# EAGLE design ROM-Adapter5 (EAGLE 9.6.2)
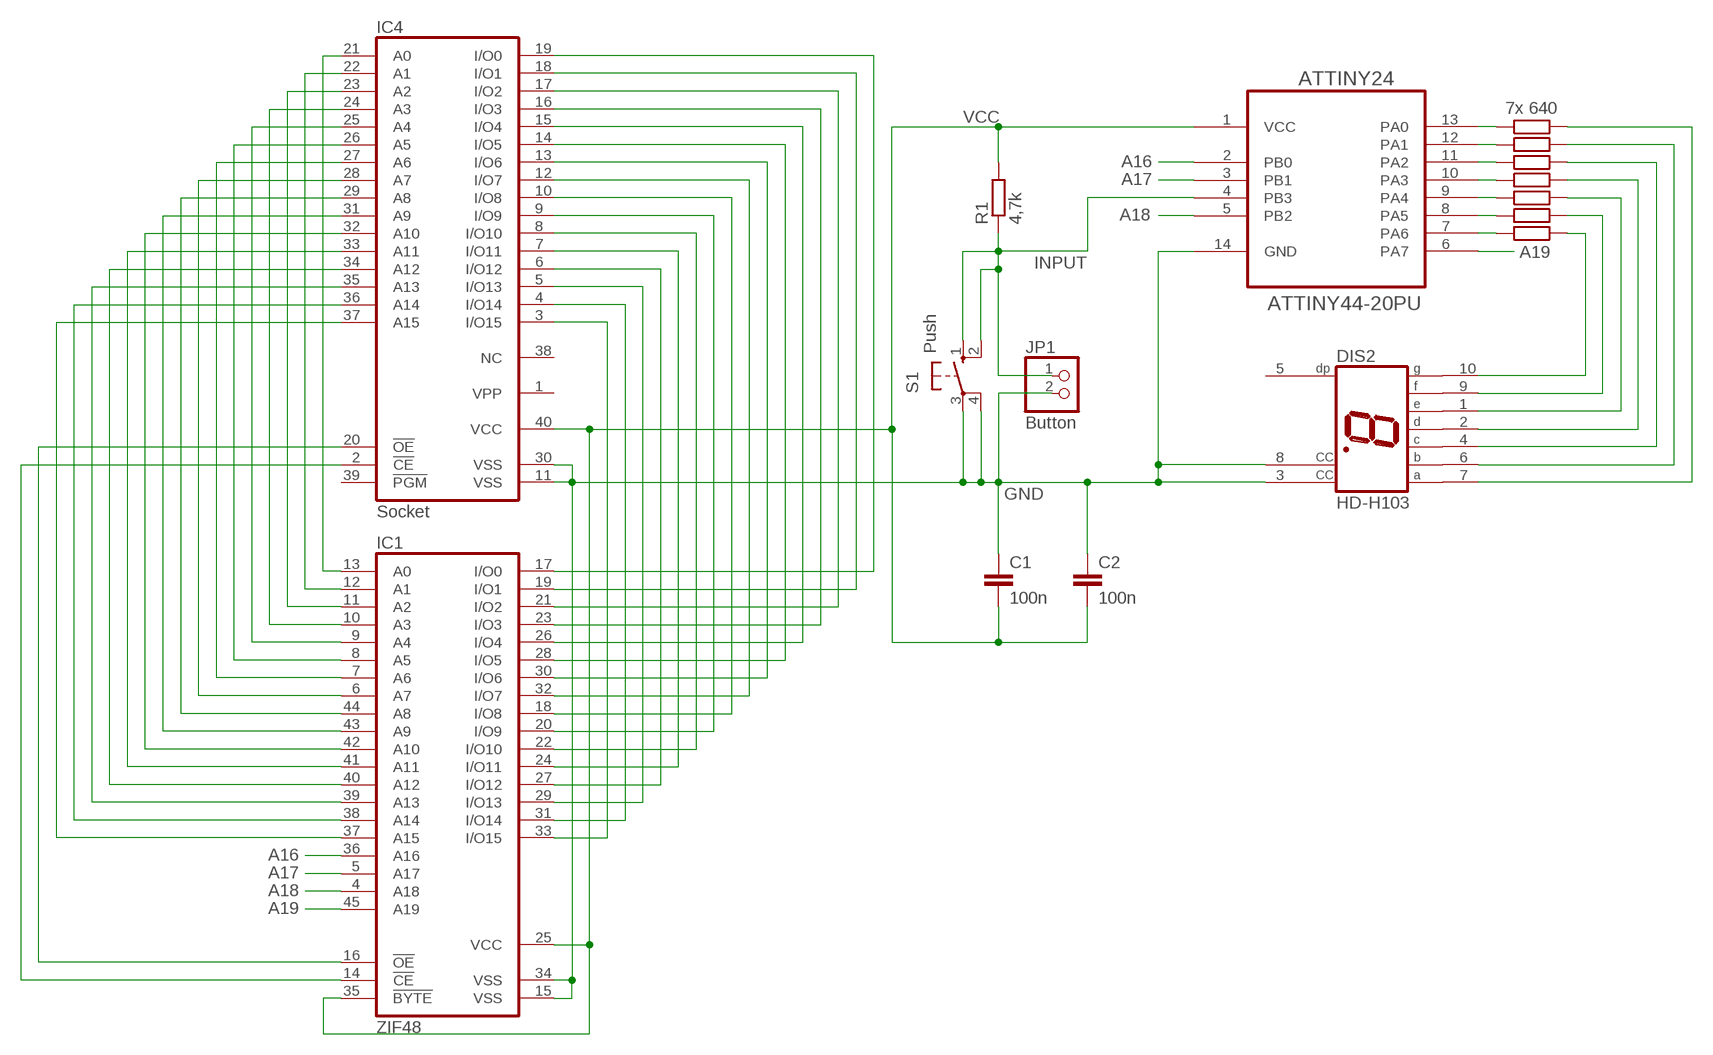
[diagram p0: schematic, sheet 1]

## Parts
ATTINY24  ATTINY44-20PU  [DIP254P762X533-14]
C1  100n  C-EU025-030X050  [C025-030X050]
C2  100n  C-EU025-030X050  [C025-030X050]
DIS2  HD-H103  [HDSP-M]
IC1  ZIF48  MEMORY-M27C160  [MEMORY-HITACHI_ZIF48]
IC4  Socket  27C1024HG  [DIL40]
JP1  Button  PINHD-1X2  [1X02]
R1  4,7k  R-EU_0207/10  [0207/10]
R2  7x 640  R-EU_0207/10  [0207/10]
R3  640  R-EU_0207/10  [0207/10]
R4  640  R-EU_0207/10  [0207/10]
R5  640  R-EU_0207/10  [0207/10]
R6  640  R-EU_0207/10  [0207/10]
R7  640  R-EU_0207/10  [0207/10]
R8  640  R-EU_0207/10  [0207/10]
S1  Push  10-XX  [B3F-10XX]

## Nets
A16: ATTINY24.2(PB0) IC1.36(A16)
A17: ATTINY24.3(PB1) IC1.5(A17)
A18: ATTINY24.5(PB2) IC1.4(A18)
A19: ATTINY24.6(PA7) IC1.45(A19)
GND [power]: ATTINY24.14(GND) C1.1 C2.1 DIS2.3(CC) DIS2.8(CC) IC1.15(VSS) IC1.34(VSS) IC4.11(VSS) IC4.30(VSS) JP1.2 S1.3(P) S1.4(P1)
INPUT: ATTINY24.4(PB3) JP1.1 R1.1 S1.1(S) S1.2(S1)
N$1: IC1.13(A0) IC4.21(A0)
N$2: IC1.12(A1) IC4.22(A1)
N$3: ATTINY24.13(PA0) R2.1
N$4: IC1.11(A2) IC4.23(A2)
N$5: IC1.10(A3) IC4.24(A3)
N$6: IC1.9(A4) IC4.25(A4)
N$7: IC1.8(A5) IC4.26(A5)
N$8: IC1.7(A6) IC4.27(A6)
N$9: IC1.6(A7) IC4.28(A7)
N$10: IC1.44(A8) IC4.29(A8)
N$11: IC1.43(A9) IC4.31(A9)
N$12: IC1.42(A10) IC4.32(A10)
N$13: IC1.41(A11) IC4.33(A11)
N$14: IC1.40(A12) IC4.34(A12)
N$15: IC1.39(A13) IC4.35(A13)
N$16: IC1.38(A14) IC4.36(A14)
N$17: IC1.37(A15) IC4.37(A15)
N$18: IC1.16(!OE) IC4.20(!OE)
N$19: IC1.14(!CE) IC4.2(!CE)
N$20: DIS2.10(G) R8.2
N$21: IC1.33(I/O15) IC4.3(I/O15)
N$22: DIS2.9(F) R7.2
N$23: IC1.31(I/O14) IC4.4(I/O14)
N$24: IC1.29(I/O13) IC4.5(I/O13)
N$25: IC1.27(I/O12) IC4.6(I/O12)
N$26: IC1.24(I/O11) IC4.7(I/O11)
N$27: IC1.22(I/O10) IC4.8(I/O10)
N$28: IC1.20(I/O9) IC4.9(I/O9)
N$29: IC1.18(I/O8) IC4.10(I/O8)
N$30: IC1.32(I/O7) IC4.12(I/O7)
N$31: IC1.30(I/O6) IC4.13(I/O6)
N$32: IC1.28(I/O5) IC4.14(I/O5)
N$33: IC1.26(I/O4) IC4.15(I/O4)
N$34: IC1.23(I/O3) IC4.16(I/O3)
N$35: IC1.21(I/O2) IC4.17(I/O2)
N$36: IC1.19(I/O1) IC4.18(I/O1)
N$37: IC1.17(I/O0) IC4.19(I/O0)
N$38: ATTINY24.12(PA1) R3.1
N$39: ATTINY24.11(PA2) R4.1
N$40: ATTINY24.10(PA3) R5.1
N$41: ATTINY24.9(PA4) R6.1
N$42: ATTINY24.8(PA5) R7.1
N$43: ATTINY24.7(PA6) R8.1
N$44: DIS2.1(E) R6.2
N$45: DIS2.2(D) R5.2
N$46: DIS2.4(C) R4.2
N$47: DIS2.6(B) R3.2
N$48: DIS2.7(A) R2.2
VCC [power]: ATTINY24.1(VCC) C1.2 C2.2 IC1.25(VCC) IC1.35(!BYTE) IC4.40(VCC) R1.2
Unconnected: DIS2.5(DP) IC4.1(VPP) IC4.38(NC) IC4.39(!PGM)

## Library data of the parts
ATTINY24 = Atmel_By_element14_Batch_1-00:ATTINY44-20PU: 8-bit Microcontroller with In-System Programmable Flash; MPN: ATTINY44-20PU; OC_FARNELL: 1455150; OC_NEWARK: 58M3786; PACKAGE: PDIP-14; SUPPLIER: Atmel
C1 C2 = rcl:C-EU: CAPACITOR, European symbol; SPICEPREFIX: C
DIS2 = display-hp:HD-H103: LED DISPLAY 1-character 7 segment, decimal point right; OC_FARNELL: unknown; OC_NEWARK: unknown
IC1 = ZIF40ROM:MEMORY-M27C160: MEMORY
IC4 = memory-hitachi:27C1024HG: MEMORY; OC_FARNELL: unknown; OC_NEWARK: unknown
JP1 = pinhead:PINHD-1X2: PIN HEADER
R1-R8 = rcl:R-EU_: RESISTOR, European symbol; SPICEPREFIX: R
S1 = switch-omron:10-XX: OMRON SWITCH; MPN: B3F-1000; OC_FARNELL: 176432; OC_NEWARK: 36M3542

## Net classes
0 default: width 0.305 mm
1 power: width 0.406 mm

## Board
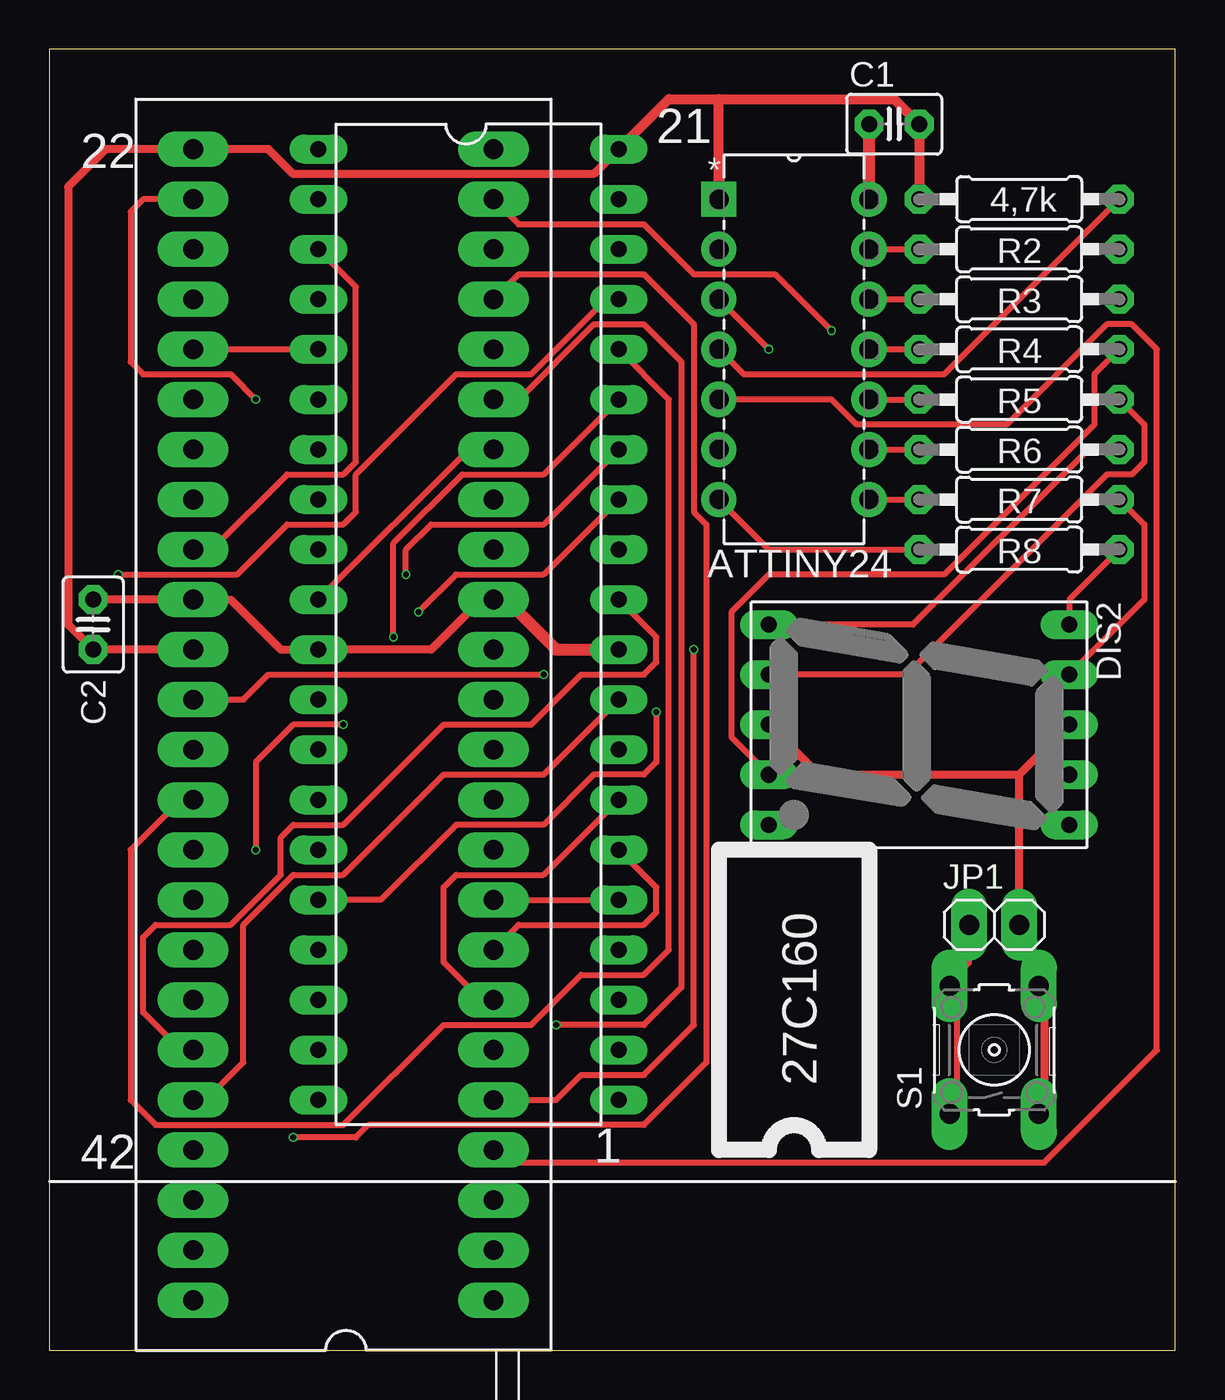
[diagram p1: board, top side]
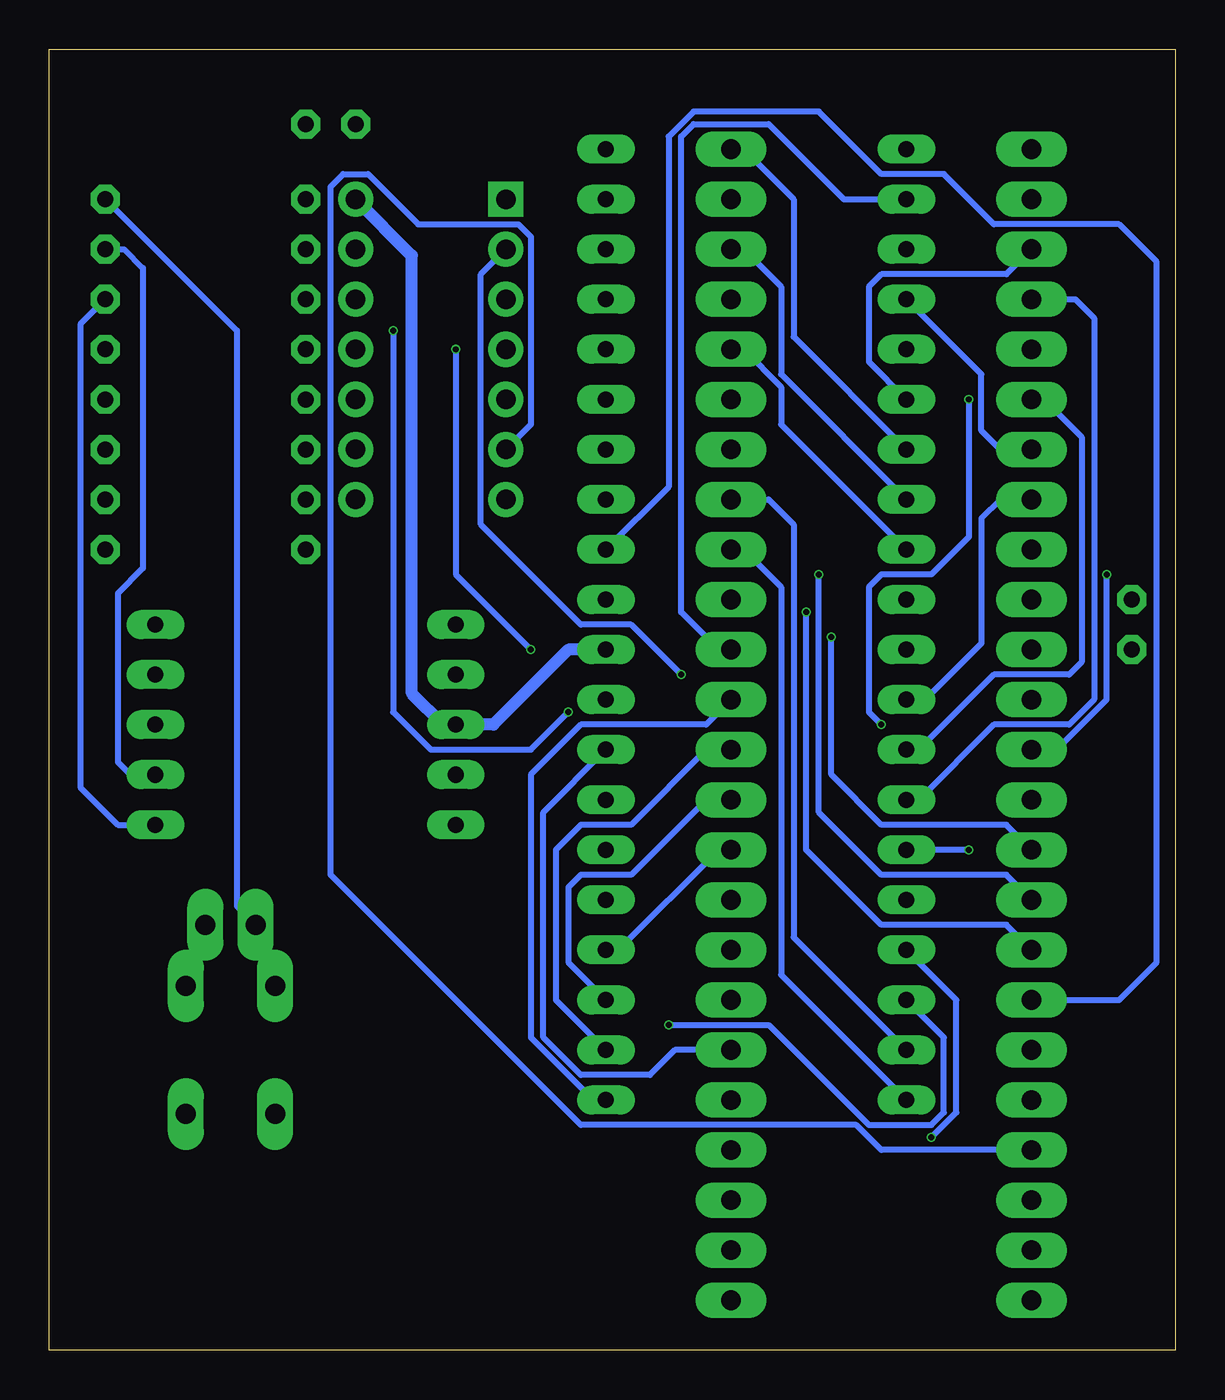
[diagram p2: board, bottom side, seen from below]

Size 57.14 x 66.03 mm. Coordinates in mm from the lower left corner, seen from the top.
Outline: 0,0 57.14,0 57.14,66.03 0,66.03 0,0
Copper layers (1*16): Top 0.035mm / dielectric 1.6mm / Bottom 0.035mm
Design rules "jlcpcb-2layers": minimum track width 5mil, minimum drill 0.3mm, track to track 5mil, track to pad 5mil, pad to pad 5mil, via to via 5mil, smd to smd 5mil, copper to edge 0.2mm, drill to drill 6mil, minimum pad ring 10mil, minimum via ring 3mil, stop-mask expansion 4mil, vias tented up to drill 0mil, thermal gap 10mil

### Footprints (pad centres in the part's own frame; a part is rotated, then mirrored left to right if it is on the bottom)
DIP254P762X533-14 = drill 0.991 square: 1 -7.62,15.24 | drill 0.991: 2 -7.62,12.7; 3 -7.62,10.16; 4 -7.62,7.62; 5 -7.62,5.08; 6 -7.62,2.54; 7 -7.62,0; 8 0,0; 9 0,2.54; 10 0,5.08; 11 0,7.62; 12 0,10.16; 13 0,12.7; 14 0,15.24
C025-030X050 = drill 0.813 octagon: 1 -1.27,0; 2 1.27,0
HDSP-M = drill 0.813 long: 1 -5.08,-7.62; 2 -2.54,-7.62; 3 0,-7.62; 4 2.54,-7.62; 5 5.08,-7.62; 6 5.08,7.62; 7 2.54,7.62; 8 0,7.62; 9 -2.54,7.62; 10 -5.08,7.62
MEMORY-HITACHI_ZIF48 = drill 1 long: 1 -24.13,-7.62; 2 -21.59,-7.62; 3 -19.05,-7.62; 4 -16.51,-7.62; 5 -13.97,-7.62; 6 -11.43,-7.62; 7 -8.89,-7.62; 8 -6.35,-7.62; 9 -3.81,-7.62; 10 -1.27,-7.62; 11 1.27,-7.62; 12 3.81,-7.62; 13 6.35,-7.62; 14 8.89,-7.62; 15 11.43,-7.62; 16 13.97,-7.62; 17 16.51,-7.62; 18 19.05,-7.62; 19 21.59,-7.62; 20 24.13,-7.62; 21 26.67,-7.62; 22 29.21,-7.62; 23 31.75,-7.62; 24 34.29,-7.62; 25 34.29,7.62; 26 31.75,7.62; 27 29.21,7.62; 28 26.67,7.62; 29 24.13,7.62; 30 21.59,7.62; 31 19.05,7.62; 32 16.51,7.62; 33 13.97,7.62; 34 11.43,7.62; 35 8.89,7.62; 36 6.35,7.62; 37 3.81,7.62; 38 1.27,7.62; 39 -1.27,7.62; 40 -3.81,7.62; 41 -6.35,7.62; 42 -8.89,7.62; 43 -11.43,7.62; 44 -13.97,7.62; 45 -16.51,7.62; 46 -19.05,7.62; 47 -21.59,7.62; 48 -24.13,7.62
DIL40 = drill 0.813 long: 1 -24.13,-7.62; 2 -21.59,-7.62; 3 -19.05,-7.62; 4 -16.51,-7.62; 5 -13.97,-7.62; 6 -11.43,-7.62; 7 -8.89,-7.62; 8 -6.35,-7.62; 9 -3.81,-7.62; 10 -1.27,-7.62; 11 1.27,-7.62; 12 3.81,-7.62; 13 6.35,-7.62; 14 8.89,-7.62; 15 11.43,-7.62; 16 13.97,-7.62; 17 16.51,-7.62; 18 19.05,-7.62; 19 21.59,-7.62; 20 24.13,-7.62; 21 24.13,7.62; 22 21.59,7.62; 23 19.05,7.62; 24 16.51,7.62; 25 13.97,7.62; 26 11.43,7.62; 27 8.89,7.62; 28 6.35,7.62; 29 3.81,7.62; 30 1.27,7.62; 31 -1.27,7.62; 32 -3.81,7.62; 33 -6.35,7.62; 34 -8.89,7.62; 35 -11.43,7.62; 36 -13.97,7.62; 37 -16.51,7.62; 38 -19.05,7.62; 39 -21.59,7.62; 40 -24.13,7.62
1X02 = drill 1.016 long: 1 -1.27,0; 2 1.27,0
0207/10 = drill 0.813 octagon: 1 -5.08,0; 2 5.08,0
B3F-10XX = drill 1.016 long: 1 -3.251,2.261; 2 3.251,2.261; 3 -3.251,-2.261; 4 3.251,-2.261

### Placement (x,y rotation side)
ATTINY24  41.59,43.18 0 top
C1  42.86,62.23 0 top
C2  2.22,36.83 270 top
DIS2  44.13,31.75 270 top
IC1  14.92,26.67 90 top
IC4  21.27,36.83 270 top
JP1  47.94,21.59 0 top
R1  49.21,58.42 180 top
R2  49.21,55.88 0 top
R3  49.21,53.34 0 top
R4  49.21,50.8 0 top
R5  49.21,48.26 0 top
R6  49.21,45.72 0 top
R7  49.21,43.18 0 top
R8  49.21,40.64 0 top
S1  47.94,15.24 90 top

### Tracks (layer width: path | path; a pad name or v marks a point on that pad's centre or on a via)
A16  (via drill 0.3)
  Top 0.305: v25.08,34.29 11.11,34.29 9.84,33.02 IC1.36
  Bottom 0.305: ATTINY24.2 35.24,54.61 35.24,41.91 30.16,36.83 27.62,36.83 v25.08,34.29
A17  (via drill 0.3)
  Top 0.305: v36.51,50.8 ATTINY24.3 | v32.7,35.56 32.7,16.51 30.16,13.97 26.99,13.97 25.72,12.7 IC1.5
  Bottom 0.305: v36.51,50.8 36.51,39.37 v32.7,35.56
A18
  Top 0.305: ATTINY24.5 39.69,48.26 40.96,46.99 48.58,46.99 53.66,52.07 54.93,52.07 56.2,50.8 56.2,15.24 50.48,9.53 23.18,9.53 IC1.4
A19
  Bottom 0.305: ATTINY24.6 32.7,46.99 32.7,56.52 33.34,57.15 38.42,57.15 40.96,59.69 42.23,59.69 42.86,59.05 42.86,24.13 30.16,11.43 16.19,11.43 14.92,10.16 IC1.45
GND
  Top 0.406: S1.3 50.48,12.06 50.48,18.41 S1.4 49.85,19.05 49.85,20.95 JP1.2 49.21,29.21 | 49.21,29.21 DIS2.8 | C2.1 IC1.34 9.21,38.1 11.75,35.56 IC4.11 19.37,35.56 21.91,38.1 IC1.15 23.18,38.1 | 49.21,29.21 39.05,29.21 DIS2.3
  Top 0.61: ATTINY24.14 C1.1 | IC4.30 25.72,35.56 23.18,38.1
  Bottom 0.406: DIS2.3 37.15,31.75
  Bottom 0.61: DIS2.3 34.61,31.75 30.8,35.56 IC4.30 | ATTINY24.14 38.74,55.56 38.74,33.34 37.15,31.75
INPUT
  Top 0.305: S1.1 46.04,12.06 46.04,18.41 S1.2 46.04,19.05 46.67,19.68 JP1.1 | R1.1 45.4,49.53 35.24,49.53 ATTINY24.4
  Bottom 0.305: JP1.1 47.63,22.54 47.63,51.75 R1.1
N$1
  Bottom 0.305: IC4.21 29.53,12.7 32.7,15.88 32.7,29.21 30.16,31.75 23.81,31.75 IC1.13
N$2
  Bottom 0.305: IC4.22 31.43,17.78 31.43,25.4 30.16,26.67 27.62,26.67 23.81,30.48 IC1.12
N$3
  Top 0.305: ATTINY24.13 R2.1
N$4
  Bottom 0.305: IC4.23 30.8,19.68 30.8,23.5 30.16,24.13 27.62,24.13 23.81,27.94 IC1.11
N$5
  Bottom 0.305: IC4.24 28.26,20.32 23.18,25.4 IC1.10
N$6
  Top 0.305: IC1.9 IC4.25
N$7
  Top 0.305: IC4.26 30.8,23.5 30.8,22.23 30.16,21.59 23.81,21.59 IC1.8
N$8
  Top 0.305: IC4.27 25.08,24.13 20.64,24.13 20,23.5 20,19.68 21.91,17.78 IC1.7
N$9
  Bottom 0.305: IC4.28 32.07,27.3 32.07,15.88 30.16,13.97 26.67,13.97 25.4,15.24 IC1.6
N$10
  Top 0.305: IC4.29 25.08,29.21 20,29.21 14.92,24.13 12.38,24.13 9.84,21.59 9.84,14.61 7.94,12.7 IC1.44
N$11
  Top 0.305: IC4.31 30.8,36.2 30.8,34.92 30.16,34.29 26.99,34.29 24.45,31.75 20,31.75 14.92,26.67 12.38,26.67 11.75,26.04 11.75,24.13 9.21,21.59 5.4,21.59 4.76,20.95 4.76,17.14 6.67,15.24 IC1.43
N$12
  Bottom 0.305: IC4.32 25.72,43.81 25.72,61.59 24.45,62.87 18.1,62.87 14.92,59.69 11.75,59.69 9.21,57.15 2.86,57.15 0.95,55.24 0.95,19.68 2.86,17.78 IC1.42
N$13  (via drill 0.3)
  Top 0.305: IC4.33 25.08,39.37 20.64,39.37 v18.73,37.47
  Bottom 0.305: v18.73,37.47 18.73,25.4 14.92,21.59 8.57,21.59 IC1.41
N$14  (via drill 0.3)
  Top 0.305: IC4.34 25.08,41.91 19.37,41.91 18.1,40.64 v18.1,39.37
  Bottom 0.305: v18.1,39.37 18.1,27.3 14.92,24.13 8.57,24.13 IC1.40
N$15  (via drill 0.3)
  Top 0.305: IC4.35 25.08,44.45 20.96,44.45 17.46,40.96 v17.46,36.2
  Bottom 0.305: v17.46,36.2 17.46,29.21 14.92,26.67 8.57,26.67 IC1.39
N$16
  Top 0.305: IC4.36 31.43,48.26 31.43,20.32 30.16,19.05 26.99,19.05 24.45,16.51 20,16.51 14.92,11.43 5.4,11.43 4.13,12.7 4.13,25.4 6.67,27.94 IC1.38
N$17  (via drill 0.3)
  Top 0.305: IC4.37 28.26,53.34 24.45,49.53 20.64,49.53 15.56,44.45 15.56,42.55 14.92,41.91 12.06,41.91 9.53,39.37 v3.49,39.37
  Bottom 0.305: v3.49,39.37 3.49,33.02 6.03,30.48 IC1.37
N$18
  Bottom 0.305: IC4.20 20,19.05 20,38.73 21.91,40.64 IC1.16
N$19
  Bottom 0.305: IC4.2 16.83,58.42 20.64,62.23 24.45,62.23 25.08,61.59 25.08,37.47 23.18,35.56 IC1.14
N$20
  Top 0.305: DIS2.10 51.75,38.1 R8.2
N$21
  Top 0.305: IC4.3 15.56,53.98 15.56,45.09 14.92,44.45 12.06,44.45 8.25,40.64 IC1.33
N$22
  Top 0.305: DIS2.9 55.56,38.1 55.56,41.91 R7.2
N$23
  Bottom 0.305: IC4.4 9.84,49.53 9.84,46.67 8.89,45.72 IC1.31
N$24
  Top 0.305: IC1.29 IC4.5
N$25
  Bottom 0.305: IC4.6 15.56,50.16 15.56,53.98 14.92,54.61 8.57,54.61 IC1.27
N$26
  Bottom 0.305: IC4.7 19.37,51.44 19.37,58.42 21.91,60.96 IC1.24
N$27
  Bottom 0.305: IC4.8 20,49.53 20,53.98 21.91,55.88 IC1.22
N$28
  Bottom 0.305: IC4.9 20,46.99 20,48.9 21.91,50.8 IC1.20
N$29
  Top 0.305: IC4.10 21.27,45.72 IC1.18
N$30
  Bottom 0.305: IC4.12 12.7,33.02 9.84,35.88 9.84,42.23 8.89,43.18 IC1.32
N$31
  Bottom 0.305: IC4.13 13.02,30.48 9.21,34.29 5.4,34.29 4.76,34.92 4.76,46.35 6.67,48.26 IC1.30
N$32
  Bottom 0.305: IC4.14 13.02,27.94 9.21,31.75 5.4,31.75 4.13,33.02 4.13,52.39 5.08,53.34 IC1.28
N$33  (via drill 0.3)
  Top 0.305: v10.48,25.4 10.48,29.84 12.38,31.75 v14.92,31.75 | v10.48,48.26 9.21,49.53 4.76,49.53 4.13,50.16 4.13,57.78 4.76,58.42 IC1.26
  Bottom 0.305: v10.48,25.4 IC4.15 | v14.92,31.75 15.56,32.38 15.56,38.73 14.92,39.37 12.38,39.37 10.48,41.27 v10.48,48.26
N$34  (via drill 0.3)
  Top 0.305: IC4.16 16.83,22.86 20.64,26.67 25.08,26.67 27.62,29.21 30.16,29.21 30.8,29.84 v30.8,32.38 | v39.69,51.75 36.83,54.61 32.7,54.61 30.16,57.15 23.81,57.15 IC1.23
  Bottom 0.305: v30.8,32.38 32.7,30.48 37.78,30.48 39.69,32.38 v39.69,51.75
N$35  (via drill 0.3)
  Top 0.305: v12.38,10.79 15.56,10.79 16.19,11.43 30.16,11.43 33.34,14.61 33.34,41.91 32.7,42.55 32.7,52.07 30.16,54.61 23.81,54.61 IC1.21
  Bottom 0.305: IC4.17 11.11,17.78 11.11,12.06 v12.38,10.79
N$36  (via drill 0.3)
  Top 0.305: v25.72,16.51 30.16,16.51 32.07,18.41 32.07,50.16 30.16,52.07 27.62,52.07 23.81,48.26 IC1.19
  Bottom 0.305: IC4.18 11.75,15.88 11.75,12.06 12.38,11.43 15.56,11.43 20.64,16.51 v25.72,16.51
N$37
  Bottom 0.305: IC4.19 19.37,20.95 19.37,41.91 20.64,43.18 IC1.17
N$38
  Top 0.305: ATTINY24.12 R3.1
N$39
  Top 0.305: ATTINY24.11 R4.1
N$40
  Top 0.305: ATTINY24.10 R5.1
N$41
  Top 0.305: ATTINY24.9 R6.1
N$42
  Top 0.305: ATTINY24.8 R7.1
N$43
  Top 0.305: R8.1 36.51,40.64 ATTINY24.7
N$44
  Top 0.305: DIS2.1 43.82,36.83 52.71,45.72 R6.2
N$45
  Top 0.305: DIS2.2 43.5,34.29 53.66,44.45 54.93,44.45 55.56,45.09 55.56,46.99 R5.2
N$46
  Top 0.305: DIS2.4 34.61,31.11 34.61,37.47 36.51,39.37 45.4,39.37 53.02,46.99 53.02,49.53 R4.2
N$47
  Bottom 0.305: DIS2.6 53.66,26.67 55.56,28.57 55.56,52.07 R3.2
N$48
  Bottom 0.305: DIS2.7 53.02,29.21 53.66,29.84 53.66,38.42 52.39,39.69 52.39,54.93 53.34,55.88 R2.2
VCC
  Top 0.406: IC1.35 C2.2 0.95,36.83 0.95,59.05 2.86,60.96 IC1.25 11.11,60.96 12.38,59.69 27.62,59.69 IC4.40
  Top 0.508: IC4.40 31.43,63.5 33.97,63.5 | 33.97,63.5 42.86,63.5 C1.2 R1.2 | ATTINY24.1 33.97,63.5

### Text on the board
tPlace: 21 | 22 | 4,7k | 27C160 | 1 | 42